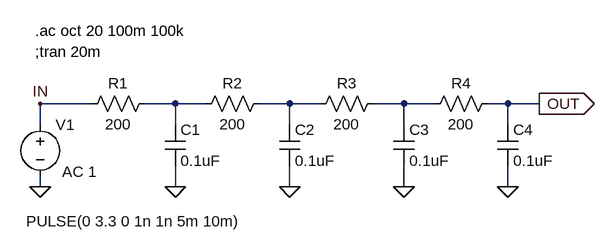
[diagram p0: schematic ArduinoLFO_RC_4thLPF.asc]
ArduinoLFO_RC_4thLPF.asc, the LTspice schematic file:
Version 4
SHEET 1 1124 680
WIRE 272 96 192 96
WIRE 400 96 352 96
WIRE 448 96 400 96
WIRE 576 96 528 96
WIRE 624 96 576 96
WIRE 752 96 704 96
WIRE 800 96 752 96
WIRE 912 96 880 96
WIRE 960 96 912 96
WIRE 192 128 192 96
WIRE 400 128 400 96
WIRE 576 128 576 96
WIRE 752 128 752 96
WIRE 912 128 912 96
WIRE 192 224 192 208
WIRE 400 224 400 192
WIRE 576 224 576 192
WIRE 752 224 752 192
WIRE 912 224 912 192
FLAG 192 224 0
FLAG 192 96 IN
FLAG 400 224 0
FLAG 960 96 OUT
IOPIN 960 96 Out
FLAG 576 224 0
FLAG 752 224 0
FLAG 912 224 0
SYMBOL voltage 192 112 R0
WINDOW 3 -22 165 Left 2
WINDOW 123 34 89 Left 2
WINDOW 39 0 0 Left 2
SYMATTR Value PULSE(0 3.3 0 1n 1n 5m 10m)
SYMATTR Value2 AC 1
SYMATTR InstName V1
SYMBOL cap 384 128 R0
SYMATTR InstName C1
SYMATTR Value 0.1uF
SYMBOL res 368 80 R90
WINDOW 0 0 56 VBottom 2
WINDOW 3 32 56 VTop 2
SYMATTR InstName R1
SYMATTR Value 200
SYMBOL cap 560 128 R0
SYMATTR InstName C2
SYMATTR Value 0.1uF
SYMBOL res 544 80 R90
WINDOW 0 0 56 VBottom 2
WINDOW 3 32 56 VTop 2
SYMATTR InstName R2
SYMATTR Value 200
SYMBOL cap 736 128 R0
SYMATTR InstName C3
SYMATTR Value 0.1uF
SYMBOL res 720 80 R90
WINDOW 0 0 56 VBottom 2
WINDOW 3 32 56 VTop 2
SYMATTR InstName R3
SYMATTR Value 200
SYMBOL cap 896 128 R0
SYMATTR InstName C4
SYMATTR Value 0.1uF
SYMBOL res 896 80 R90
WINDOW 0 0 56 VBottom 2
WINDOW 3 32 56 VTop 2
SYMATTR InstName R4
SYMATTR Value 200
TEXT 184 16 Left 2 !;tran 20m
TEXT 184 -16 Left 2 !.ac oct 20 100m 100k

The netlist it stands for:
* ArduinoLFO_RC_4thLPF.asc
V1 IN 0 PULSE(0 3.3 0 1n 1n 5m 10m) AC 1
C1 N001 0 0.1uF
R1 N001 IN 200
C2 N002 0 0.1uF
R2 N002 N001 200
C3 N003 0 0.1uF
R3 N003 N002 200
C4 OUT 0 0.1uF
R4 OUT N003 200
;tran 20m
.ac oct 20 100m 100k
.backanno
.end